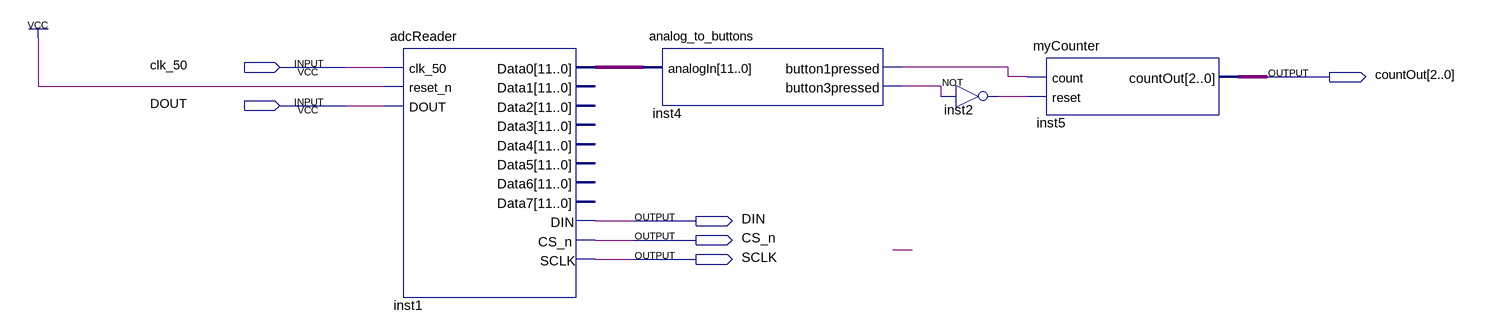
[diagram p0: schematic sheet]
// Quartus schematic CounterWithOutput.bdf as structural Verilog: 4 symbols, 6 pins
module CounterWithOutput (
  input  clk_50,
  input  DOUT,
  output [2:0] countOut,
  output DIN,
  output CS_n,
  output SCLK
);

  wire inst2_out, inst4_button1pressed, inst4_button3pressed;
  wire [11:0] inst1_data0;

  adcReader inst1 (
    .clk_50(clk_50), .reset_n(1'b1), .DOUT(DOUT), .Data0(inst1_data0), .DIN(DIN), .CS_n(CS_n), .SCLK(SCLK));  // open: Data1, Data2, Data3, Data4, Data5, Data6, Data7
  analog_to_buttons inst4 (
    .analogIn(inst1_data0), .button1pressed(inst4_button1pressed), .button3pressed(inst4_button3pressed));
  not inst2 (inst2_out, inst4_button3pressed);
  myCounter inst5 (.count(inst4_button1pressed), .reset(inst2_out), .countOut(countOut));
endmodule
